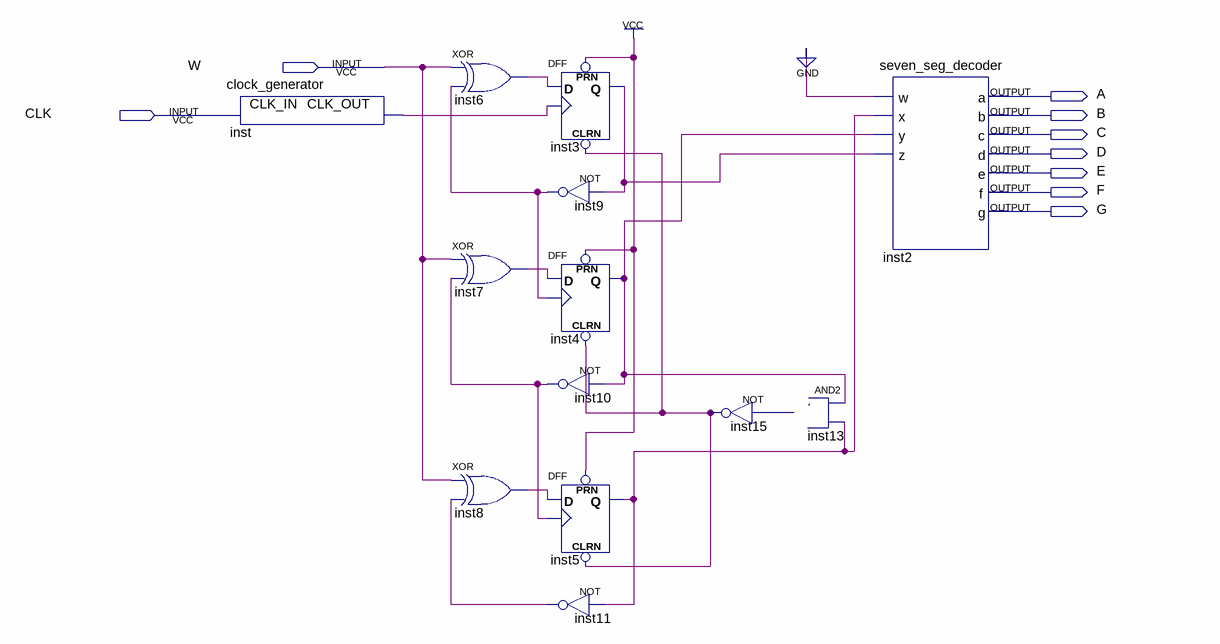
[diagram p0: schematic sheet]
// Quartus schematic lab11step0.bdf as structural Verilog: 13 symbols, 9 pins
module lab11step0 (
  input  W,
  input  CLK,
  output A,
  output B,
  output C,
  output D,
  output E,
  output F,
  output G
);

  wire inst3_q, inst4_q, inst5_q, inst6_out, inst7_out, inst8_out, inst9_out, inst10_out, inst11_out,
       inst13_out, inst15_out, inst_clk_out;

  clock_generator inst (.CLK_IN(CLK), .CLK_OUT(inst_clk_out));
  xor inst6 (inst6_out, W, inst9_out);
  xor inst7 (inst7_out, W, inst10_out);
  xor inst8 (inst8_out, W, inst11_out);
  DFF inst3 (.CLRN(inst15_out), .CLK(inst_clk_out), .D(inst6_out), .PRN(1'b1), .Q(inst3_q));
  not inst9 (inst9_out, inst3_q);
  DFF inst4 (.CLRN(inst15_out), .CLK(inst9_out), .D(inst7_out), .PRN(1'b1), .Q(inst4_q));
  not inst10 (inst10_out, inst4_q);
  DFF inst5 (.CLRN(inst15_out), .CLK(inst10_out), .D(inst8_out), .PRN(1'b1), .Q(inst5_q));
  not inst11 (inst11_out, inst5_q);
  not inst15 (inst15_out, inst13_out);
  and inst13 (inst13_out, inst4_q, inst5_q);
  seven_seg_decoder inst2 (
    .w(1'b0), .x(inst5_q), .y(inst4_q), .z(inst3_q), .a(A), .b(B), .c(C), .d(D), .e(E), .f(F), .g(G));
endmodule
